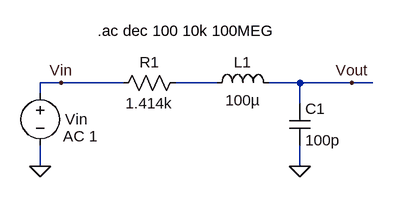
[diagram p0: schematic _Fig3_36_MSD.asc]
_Fig3_36_MSD.asc, the LTspice schematic file:
Version 4
SHEET 1 2740 696
WIRE 432 -336 432 -352
WIRE 432 -224 432 -256
WIRE 464 -352 432 -352
WIRE 560 -352 464 -352
WIRE 704 -352 640 -352
WIRE 832 -352 784 -352
WIRE 832 -320 832 -352
WIRE 832 -224 832 -256
WIRE 912 -352 832 -352
WIRE 944 -352 912 -352
FLAG 432 -224 0
FLAG 832 -224 0
FLAG 912 -352 Vout
FLAG 464 -352 Vin
SYMBOL voltage 432 -352 R0
WINDOW 0 38 56 Left 0
WINDOW 123 35 82 Left 0
WINDOW 39 0 0 Left 0
SYMATTR InstName Vin
SYMATTR Value2 AC 1
SYMATTR Value ""
SYMBOL ind 800 -336 M270
WINDOW 0 32 56 VTop 0
WINDOW 3 5 56 VBottom 0
SYMATTR InstName L1
SYMATTR Value 100µ
SYMBOL res 544 -336 R270
WINDOW 0 32 56 VTop 0
WINDOW 3 0 56 VBottom 0
SYMATTR InstName R1
SYMATTR Value 1.414k
SYMBOL cap 816 -320 R0
SYMATTR InstName C1
SYMATTR Value 100p
TEXT 520 -432 Left 0 !.ac dec 100 10k 100MEG

The netlist it stands for:
* _Fig3_36_MSD.asc
Vin Vin 0 AC 1
L1 Vout N001 100µ
R1 Vin N001 1.414k
C1 Vout 0 100p
.ac dec 100 10k 100MEG
.backanno
.end